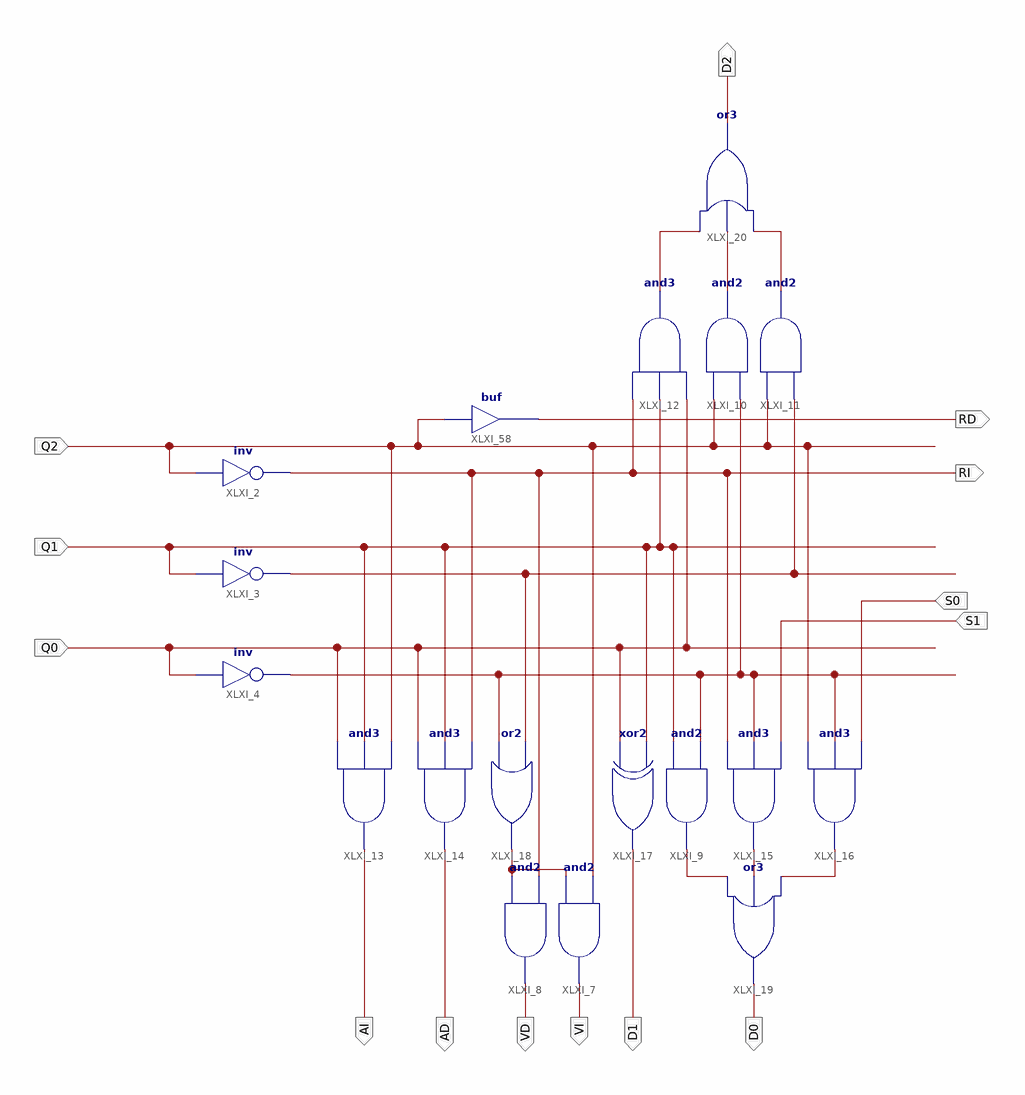
[diagram p0: schematic sheet 1]
// Xilinx ISE schematic p4ej1.sch (spartan3) as structural Verilog: 18 symbols, 14 ports
module p4ej1 (
  input  Q2,
  input  Q1,
  input  Q0,
  input  S1,
  input  S0,
  output RI,
  output RD,
  output D2,
  output AI,
  output VD,
  output AD,
  output VI,
  output D1,
  output D0
);

  wire XLXN_5, XLXN_6, XLXN_9, XLXN_21, XLXN_22, XLXN_23, XLXN_33, XLXN_34, XLXN_35;

  and XLXI_10 (XLXN_22, XLXN_6, Q2);
  and XLXI_11 (XLXN_23, XLXN_5, Q2);
  or XLXI_20 (D2, XLXN_23, XLXN_22, XLXN_21);
  not XLXI_4 (XLXN_6, Q0);
  not XLXI_3 (XLXN_5, Q1);
  not XLXI_2 (RI, Q2);
  and XLXI_13 (AI, Q0, Q1, Q2);
  and XLXI_14 (AD, Q0, Q1, RI);
  or XLXI_18 (XLXN_9, XLXN_6, XLXN_5);
  and XLXI_8 (VD, XLXN_9, RI);
  and XLXI_7 (VI, XLXN_9, Q2);
  xor XLXI_17 (D1, Q0, Q1);
  and XLXI_9 (XLXN_33, Q1, XLXN_6);
  and XLXI_15 (XLXN_34, RI, XLXN_6, S1);
  and XLXI_16 (XLXN_35, Q2, XLXN_6, S0);
  or XLXI_19 (D0, XLXN_33, XLXN_34, XLXN_35);
  and XLXI_12 (XLXN_21, Q0, Q1, RI);
  buf XLXI_58 (RD, Q2);
endmodule
